# Altium schematic sheet TOP.SchDoc: =DocumentName
size A4; Organization: Queen's Formula SAE; Address1: 130 Stuart St, Kingston; Address2: Ontario; Address3: Canada; Address4: K7L 2V9; DocumentNumber: 1; Revision: 0; SheetNumber: 1; SheetTotal: 1
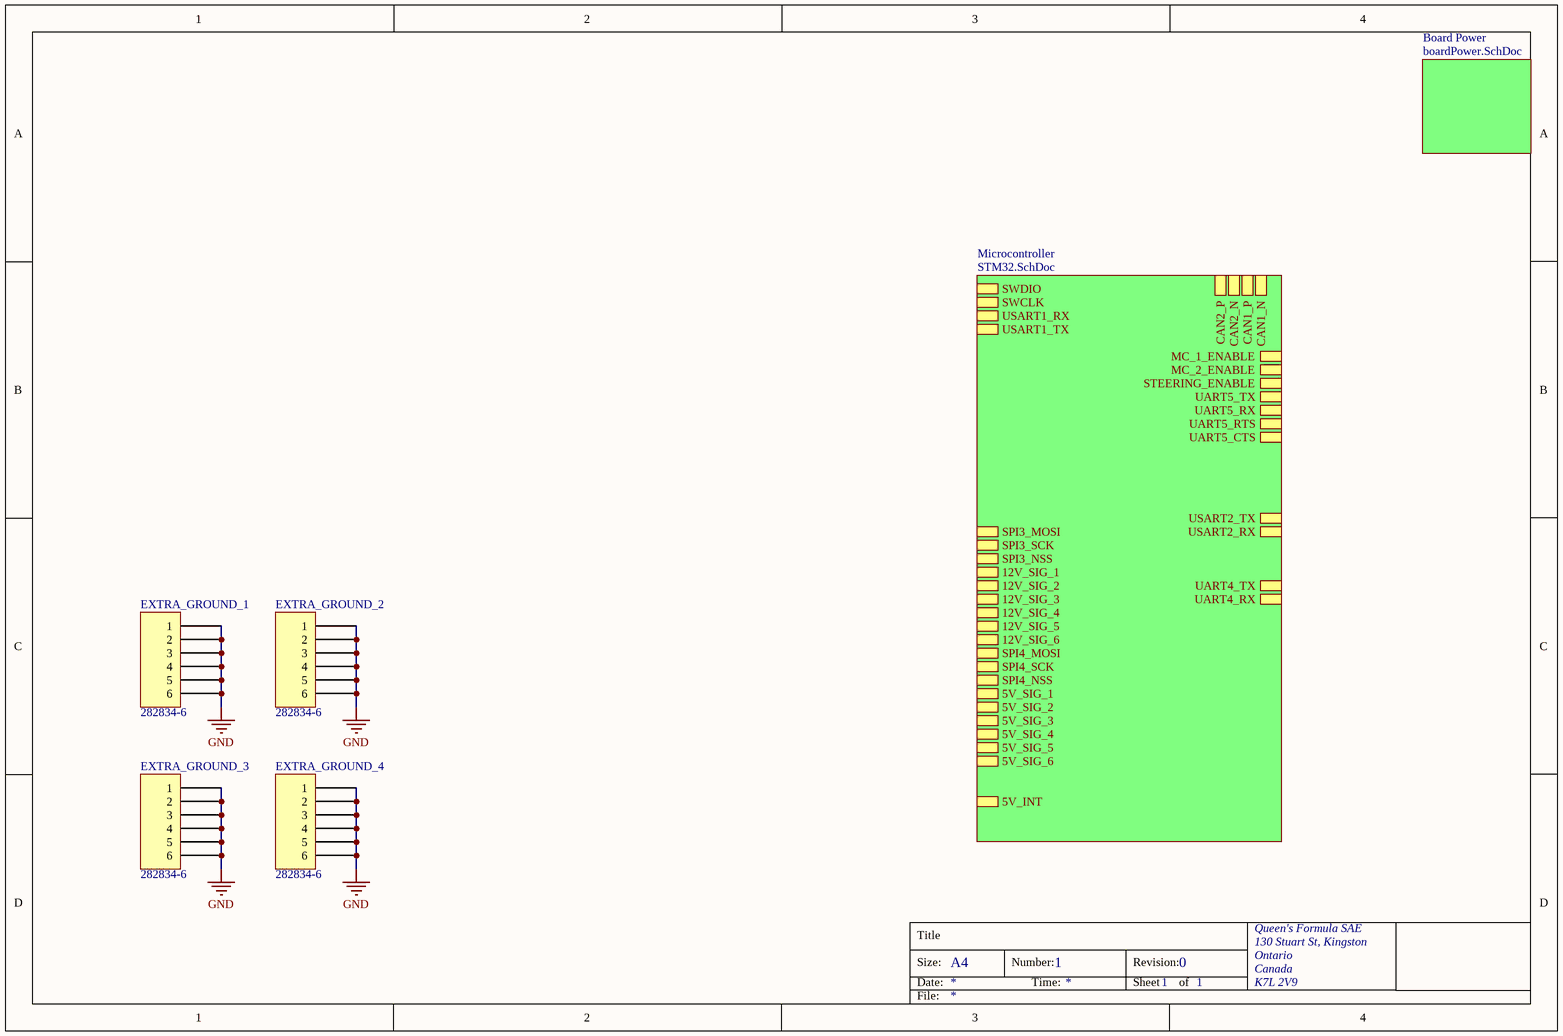
[diagram p0: TOP.SchDoc]

## Parts
EXTRA_GROUND_1  282834-6  [TE 282834-6]
EXTRA_GROUND_2  282834-6  [TE 282834-6]
EXTRA_GROUND_3  282834-6  [TE 282834-6]
EXTRA_GROUND_4  282834-6  [TE 282834-6]

## Sub-sheets
Board Power = boardPower.SchDoc: no entries
Microcontroller = STM32.SchDoc: SWDIO, SWCLK, USART1_RX, USART1_TX, SPI3_NSS, SPI3_MOSI, SPI3_SCK, CAN1_P, CAN1_N, CAN2_N, CAN2_P, 12V_SIG_1, MC_1_ENABLE, MC_2_ENABLE, STEERING_ENABLE, 12V_SIG_2, 12V_SIG_4, 12V_SIG_3, 12V_SIG_5, 12V_SIG_6, SPI4_NSS, SPI4_MOSI, SPI4_SCK, 5V_SIG_1, 5V_SIG_2, 5V_SIG_3, 5V_SIG_5, 5V_SIG_4, 5V_SIG_6, UART5_TX, UART5_RX, UART5_RTS, UART5_CTS, 5V_INT, USART2_TX, USART2_RX, UART4_TX, UART4_RX

## Nets
GND: EXTRA_GROUND_1.1 EXTRA_GROUND_1.2 EXTRA_GROUND_1.3 EXTRA_GROUND_1.4 EXTRA_GROUND_1.5 EXTRA_GROUND_1.6 EXTRA_GROUND_2.1 EXTRA_GROUND_2.2 EXTRA_GROUND_2.3 EXTRA_GROUND_2.4 EXTRA_GROUND_2.5 EXTRA_GROUND_2.6 EXTRA_GROUND_3.1 EXTRA_GROUND_3.2 EXTRA_GROUND_3.3 EXTRA_GROUND_3.4 EXTRA_GROUND_3.5 EXTRA_GROUND_3.6 EXTRA_GROUND_4.1 EXTRA_GROUND_4.2 EXTRA_GROUND_4.3 EXTRA_GROUND_4.4 EXTRA_GROUND_4.5 EXTRA_GROUND_4.6

## Notes on the sheet
- Title
- Size:
- Date:
- A4
- Number:
- Time:
- Revision:
- Sheet
- of
- File:

## Library data of the parts
EXTRA_GROUND_1-EXTRA_GROUND_4 = 282834-6: TERM BLK 6P SIDE ENT 2.54MM PCB; Manufacturer: TE Connectivity AMP Connectors; Current: 10A; Mating Orientation: Horizontal with Board; Number of Levels: 1; Pitch: 0.100" (2.54mm); Positions Per Level: 6; Voltage: 150V; Wire Gauge: 16-30 AWG; Wire Termination: Screw - Rising Cage Clamp; Part Number: 282834-6; Color: Green; ComponentLink1Description: Datasheet; ComponentLink1URL: https://www.te.com/commerce/DocumentDelivery/DDEController?Action=srchrtrv&DocNm=282834&DocType=Customer+Drawing&DocLang=English; ComponentLink2Description: DigiKey Link; ComponentLink2URL: http://digikey.com/product-detail/en/te-connectivity-amp-connectors/282834-6/A98337-ND/1153267; LastUpdated: 2020-01-15 4:16:31 AM; Lifecycle Status: Active; Minimum Order: 1; Mounting Type: Through Hole; Packaging: Bulk; Part Status: Active; Price: 4.72; Series: Buchanan; Supplier 1: DigiKey; Supplier Part Number 1: A98337-ND